# Altium schematic sheet 9_User input.schdoc
size 497 x 243 mm; Name: A_A4; Symbol: A_A4; Device: A_A4; @Project Name: TUD-EnergyHarvestingConsole_2022-08-29_17-01-09; REV: 1.0; Date: 2022-07-29; Sheet: 1/1; Draw By: Alejandro Cabrerizo; Convert to PCB: yes; Add into BOM: yes
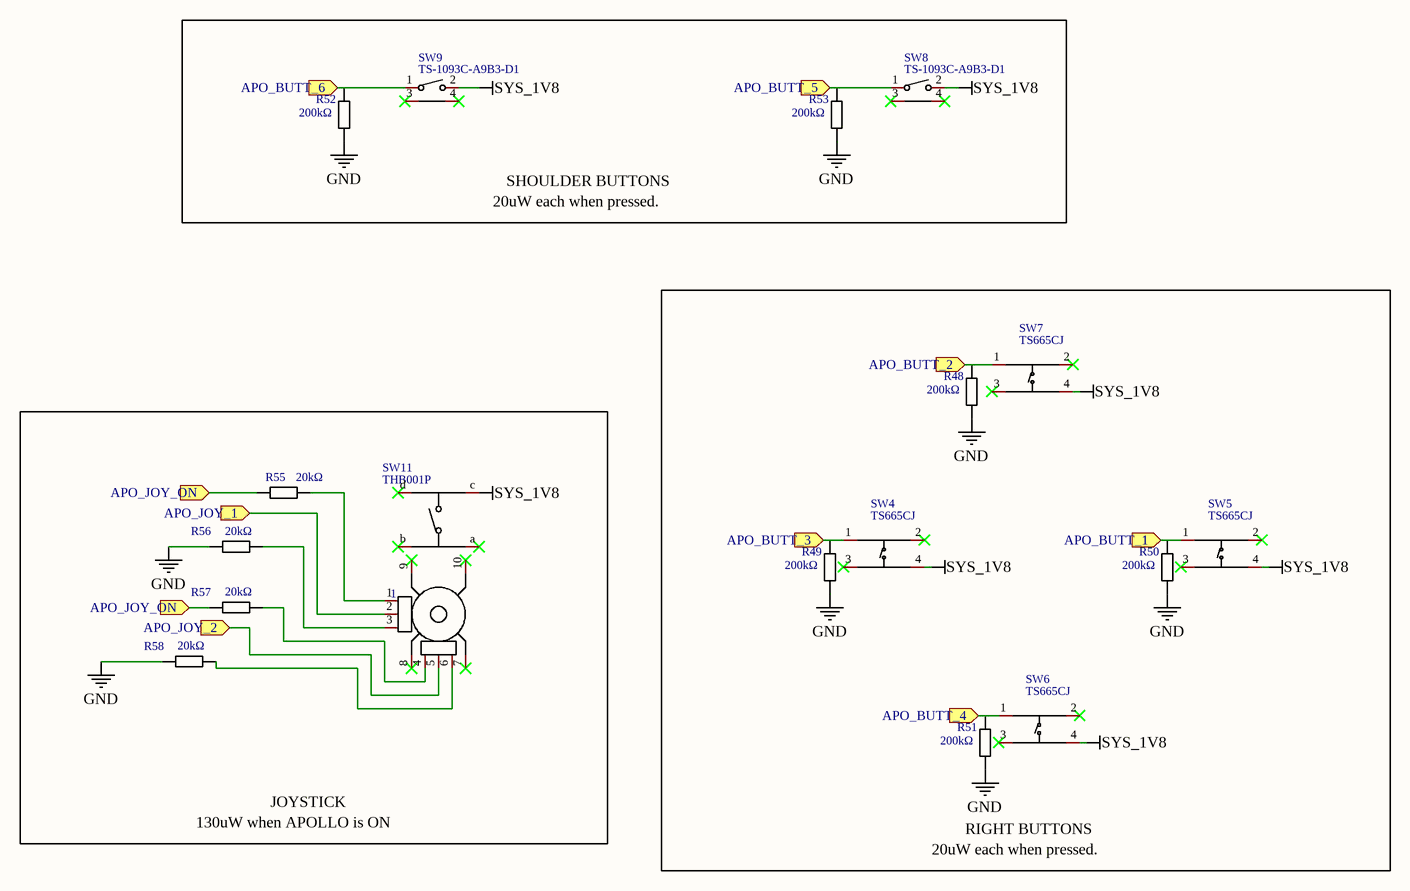
[diagram p0: 9_User input.schdoc]

## Parts
R48  200kΩ  [R0603]
R49  200kΩ  [R0603]
R50  200kΩ  [R0603]
R51  200kΩ  [R0603]
R52  200kΩ  [R0603]
R53  200kΩ  [R0603]
R55  20kΩ  [R0603]
R56  20kΩ  [R0603]
R57  20kΩ  [R0603]
R58  20kΩ  [R0603]
SW4  TS665CJ  [SW-TH_4P-L6.0-W6.0-P4.50-LS6.5]
SW5  TS665CJ  [SW-TH_4P-L6.0-W6.0-P4.50-LS6.5]
SW6  TS665CJ  [SW-TH_4P-L6.0-W6.0-P4.50-LS6.5]
SW7  TS665CJ  [SW-TH_4P-L6.0-W6.0-P4.50-LS6.5]
SW8  TS-1093C-A9B3-D1  [SW-TH_TS-1093C-A9B3-D1]
SW9  TS-1093C-A9B3-D1  [SW-TH_TS-1093C-A9B3-D1]
SW11  NUMBER: 1  [SW-TH_THB001P]  (hidden comment: THB001P)

## Ports
APO_BUTT_1 (in), APO_BUTT_2 (in), APO_BUTT_3 (in), APO_BUTT_4 (in), APO_BUTT_5 (in), APO_BUTT_6 (in), APO_JOY_1 (in), APO_JOY_2 (in), APO_JOY_ON (in)

## Nets
GND: R48.1 R49.1 R50.1 R51.1 R52.1 R53.1 R56.2 R58.2
SYS_1V8: SW4.4(D) SW5.4(D) SW6.4(D) SW7.4(D) SW8.2 SW9.2 SW11.c
APO_BUTT_1: R50.2 SW5.1(A) ; port APO_BUTT_1
APO_BUTT_2: R48.2 SW7.1(A) ; port APO_BUTT_2
APO_BUTT_3: R49.2 SW4.1(A) ; port APO_BUTT_3
APO_BUTT_4: R51.2 SW6.1(A) ; port APO_BUTT_4
APO_BUTT_5: R53.2 SW8.1 ; port APO_BUTT_5
APO_BUTT_6: R52.2 SW9.1 ; port APO_BUTT_6
APO_JOY_1: SW11.2(DTA) ; port APO_JOY_1
APO_JOY_2: SW11.5(DTA) ; port APO_JOY_2
APO_JOY_ON: R55.2 R57.2 ; port APO_JOY_ON
NetR55_1: R55.1 SW11.1(B)
NetR56_1: R56.1 SW11.3(A)
NetR57_1: R57.1 SW11.4(A)
NetR58_1: R58.1 SW11.6(B)

Not connected (* = marked no-connect by the designer): SW4 2(B)* 3(C)*; SW5 2(B)* 3(C)*; SW6 2(B)* 3(C)*; SW7 2(B)* 3(C)*; SW8 3(EP)* 4(EP)*; SW9 3(EP)* 4(EP)*; SW11 7(GND)* 8(GND)* 9(GND)* 10(GND)* a* b* d*

## Notes on the sheet
- 20uW each when pressed.
- SHOULDER BUTTONS
- 130uW when APOLLO is ON
- JOYSTICK
- RIGHT BUTTONS
- 1
- 2
- 3
- 4
- 5
- A
- B
- C
- D
- TITLE:
- TUD-EnergyHarvestingConsole_2022-08-29_17-01-09
- REV:
- 1.0
- Date:
- Company:
- 2022-07-29
- Drawn By:
- Alejandro Cabrerizo
- Sheet:
- 1/1

## Library data of the parts
R48-R53 = 0603WAF2003T5E: Manufacturer: UniOhm; Resistance: 200K; Convert to PCB: yes; Name: 200kΩ; Symbol: 200kΩ; Device: 0603WAF2003T5E; Supplier: LCSC; Manufacturer Part: 0603WAF2003T5E; Supplier Part: C25811; JLCPCB Part Class: Basic Part; Add into BOM: yes; Origin Footprint: R0603
R55-R58 = 0603WAF2002T5E: Manufacturer: UniOhm; Resistance: 20K; Convert to PCB: yes; Name: 20kΩ; Symbol: 20kΩ; Device: 0603WAF2002T5E; Supplier: LCSC; Manufacturer Part: 0603WAF2002T5E; Supplier Part: C4184; JLCPCB Part Class: Basic Part; Add into BOM: yes; Origin Footprint: R0603
SW4-SW7 = TS665CJ: Manufacturer: SHOU HAN; Convert to PCB: yes; Name: TS665CJ; Symbol: TS665CJ; Device: TS665CJ; Supplier: LCSC; Supplier Part: C393938; Manufacturer Part: TS665CJ; JLCPCB Part Class: Extended Part; Add into BOM: yes; Origin Footprint: SW-TH_4P-L6.0-W6.0-P4.50-LS6.5
SW8 SW9 = TS-1093C-A9B3-D1: Manufacturer: Yuandi; Convert to PCB: yes; Name: TS-1093C-A9B3-D1; Symbol: TS-1093C-A9B3-D1; Device: TS-1093C-A9B3-D1; Supplier: LCSC; Supplier Part: C493051; Manufacturer Part: TS-1093C-A9B3-D1; JLCPCB Part Class: Extended Part; Add into BOM: yes; Origin Footprint: SW-TH_TS-1093C-A9B3-D1
SW11 = THB001P: Manufacturer: C&K; Convert to PCB: yes; Name: THB001P; Symbol: THB001P; Device: THB001P; Supplier: LCSC; Supplier Part: C2685355; Manufacturer Part: THB001P; JLCPCB Part Class: Extended Part; Add into BOM: yes; Origin Footprint: SW-TH_THB001P